# Altium schematic sheet Sheet1.SchDoc
size A4
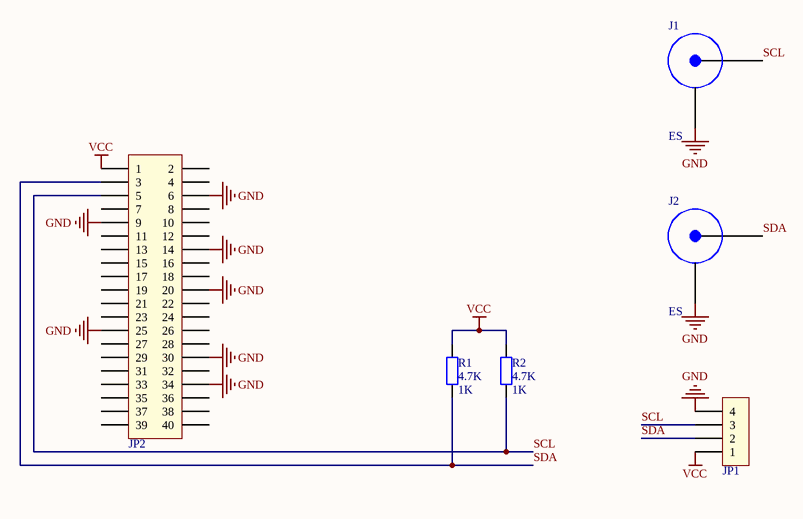
[diagram p0: Sheet1.SchDoc]

## Parts
J1  ES  [BNC]
J2  ES  [BNC]
JP1  Connecteur Autocom 4pts  [Autocom HE14 - 4 - Coudé]  (value not drawn)
JP2  HE10 2x20  [HE10 2x20]  (value not drawn)
R1  4.7K  value 1K  [AXIAL-0.4]
R2  4.7K  value 1K  [AXIAL-0.4]

## Nets
GND: J1.2(GND) J2.2(GND) JP1.4 JP2.6 JP2.9 JP2.14 JP2.20 JP2.25 JP2.30 JP2.34
VCC: JP1.1 JP2.1 R1.2 R2.2
SCL: J1.1(SIGNAL) JP1.3 JP2.5 R2.1
SDA: J2.1(SIGNAL) JP1.2 JP2.3 R1.1

Not connected (* = marked no-connect by the designer): JP2 2 4 7 8 10 11 12 13 15 16 17 18 19 21 22 23 24 26 27 28 29 31 32 33 35 36 37 38 39 40

## Library data of the parts
J1 J2 = BNC
JP1 = Connecteur Autocom 4 pts: connecteur autocom HE14 4 pts; Manufacturer: TE CONNECTIVITY / AMP; Manufacturer Part Number: 281698-4; Supplier 1: Farnell; RoHS: YES; Stock 1: 5967; Pricing 1: 5=0,55, 100=0,53, 250=0,45 (EUR); ComponentLink1URL: http://www.tycoelectronics.com/commerce/DocumentDelivery/DDEController?Action=srchrtrv&DocNm=CVM_281698-4&DocType=Customer+View+Model&DocLang=3D; ComponentLink1Description: http://www.tycoelectronics.com/commerce/DocumentDelivery/DDEController?Action=srchrtrv&DocNm=CVM_281698-4&DocType=Customer+View+Model&DocLang=3D; ComponentLink2URL: http://www.tycoelectronics.com/commerce/DocumentDelivery/DDEController?Action=srchrtrv&DocNm=281698&DocType=Customer+Drawing&DocLang=English; ComponentLink2Description: http://www.tycoelectronics.com/commerce/DocumentDelivery/DDEController?Action=srchrtrv&DocNm=281698&DocType=Customer+Drawing&DocLang=English; ComponentLink3URL: http://www.tycoelectronics.com/commerce/DocumentDelivery/DDEController?Action=srchrtrv&DocNm=108-15053&DocType=Specification+Or+Standard&DocLang=French; ComponentLink3Description: http://www.tycoelectronics.com/commerce/DocumentDelivery/DDEController?Action=srchrtrv&DocNm=108-15053&DocType=Specification+Or+Standard&DocLang=French; ComponentLink4URL: http://www.farnell.com/datasheets/23840.pdf; ComponentLink4Description: http://www.farnell.com/datasheets/23840.pdf; Supplier Part Number 1: 1205992
JP2 = HE10 2x20: Header, 20-Pin, Dual row; Manufacturer: HARTING; Manufacturer Part Number: 09 18 540 7324; Type de connecteur: Fil-à-carte; Terminaison du contact: Traversant vertical; Genre: Embase; Nombre de contacts: 40; Nombre de rangées: 2; Pas: 2.54; Plaquage du contact: Gold; Matériau du contact: Laiton; SVHC: No SVHC (20-Jun-2011); Approval Bodies: BT 224, BS 9525, F0023, NFC93-428 (HE10), MIL-C-83503, DIN 41651; Connector Type: IDC; Couleur: Gris; Courant: 1; Diamètre de perçage du circuit imprimé: 0.9; Epaisseur, coupe max., circuit imprimé: 2.4; Inflammabilité: UL94V-0; Méthode de terminaison: Broche à souder droite; Nombre de cycles d'accouplements: 100; Plaquage contact: Or; Résistance, contact: 20; Température de fonctionnement max..: 105; Température, courant: 60; Température d'utilisation min: -40; Tension VDC: 350; Tension, supportée: 1050; Type de boitier: Polyester PBT chargé verre; Supplier 1: Farnell; Supplier Part Number 1: 1096993; RoHS: YES; Stock 1: 252; Pricing 1: 1=1,96, 25=1,71, 50=1,51, 250=1,39, 500=1,28, 1000=1,23 (EUR); Contact Material: Brass; Nombre de pâles: 40; Nombre de voies: 40; Résistance, isolation: 1; Tension c.a.: 350; Tension, fonctionnement: 350; ComponentLink1URL: http://www.farnell.com/datasheets/27141.pdf; ComponentLink1Description: http://www.farnell.com/datasheets/27141.pdf
R1 R2 = Res2: Resistor; Published: 8-Jun-2000; LatestRevisionDate: 17-Jul-2002; LatestRevisionNote: Re-released for DXP Platform.; PackageReference: AXIAL-0.4; Publisher: Altium Limited; PackageDescription: Axial Device, Thru-Hole; 2 Leads; 0.4 in Pin Spacing